# Altium project pca20053.PrjPCB (part 3 of 4)

## Sheet pca20053_sheet6_interface.SchDoc: Thingy:53 Interface
size A3; Organization: Nordic Semiconductor; DocumentNumber: 6; Revision: 1.1.0; SheetNumber: 6; SheetTotal: 6; Author: MASI; CompanyName: Nordic Semiconductor; DrawnBy: MASI; DocumentSize: A3; ProjectName: Thingy:53
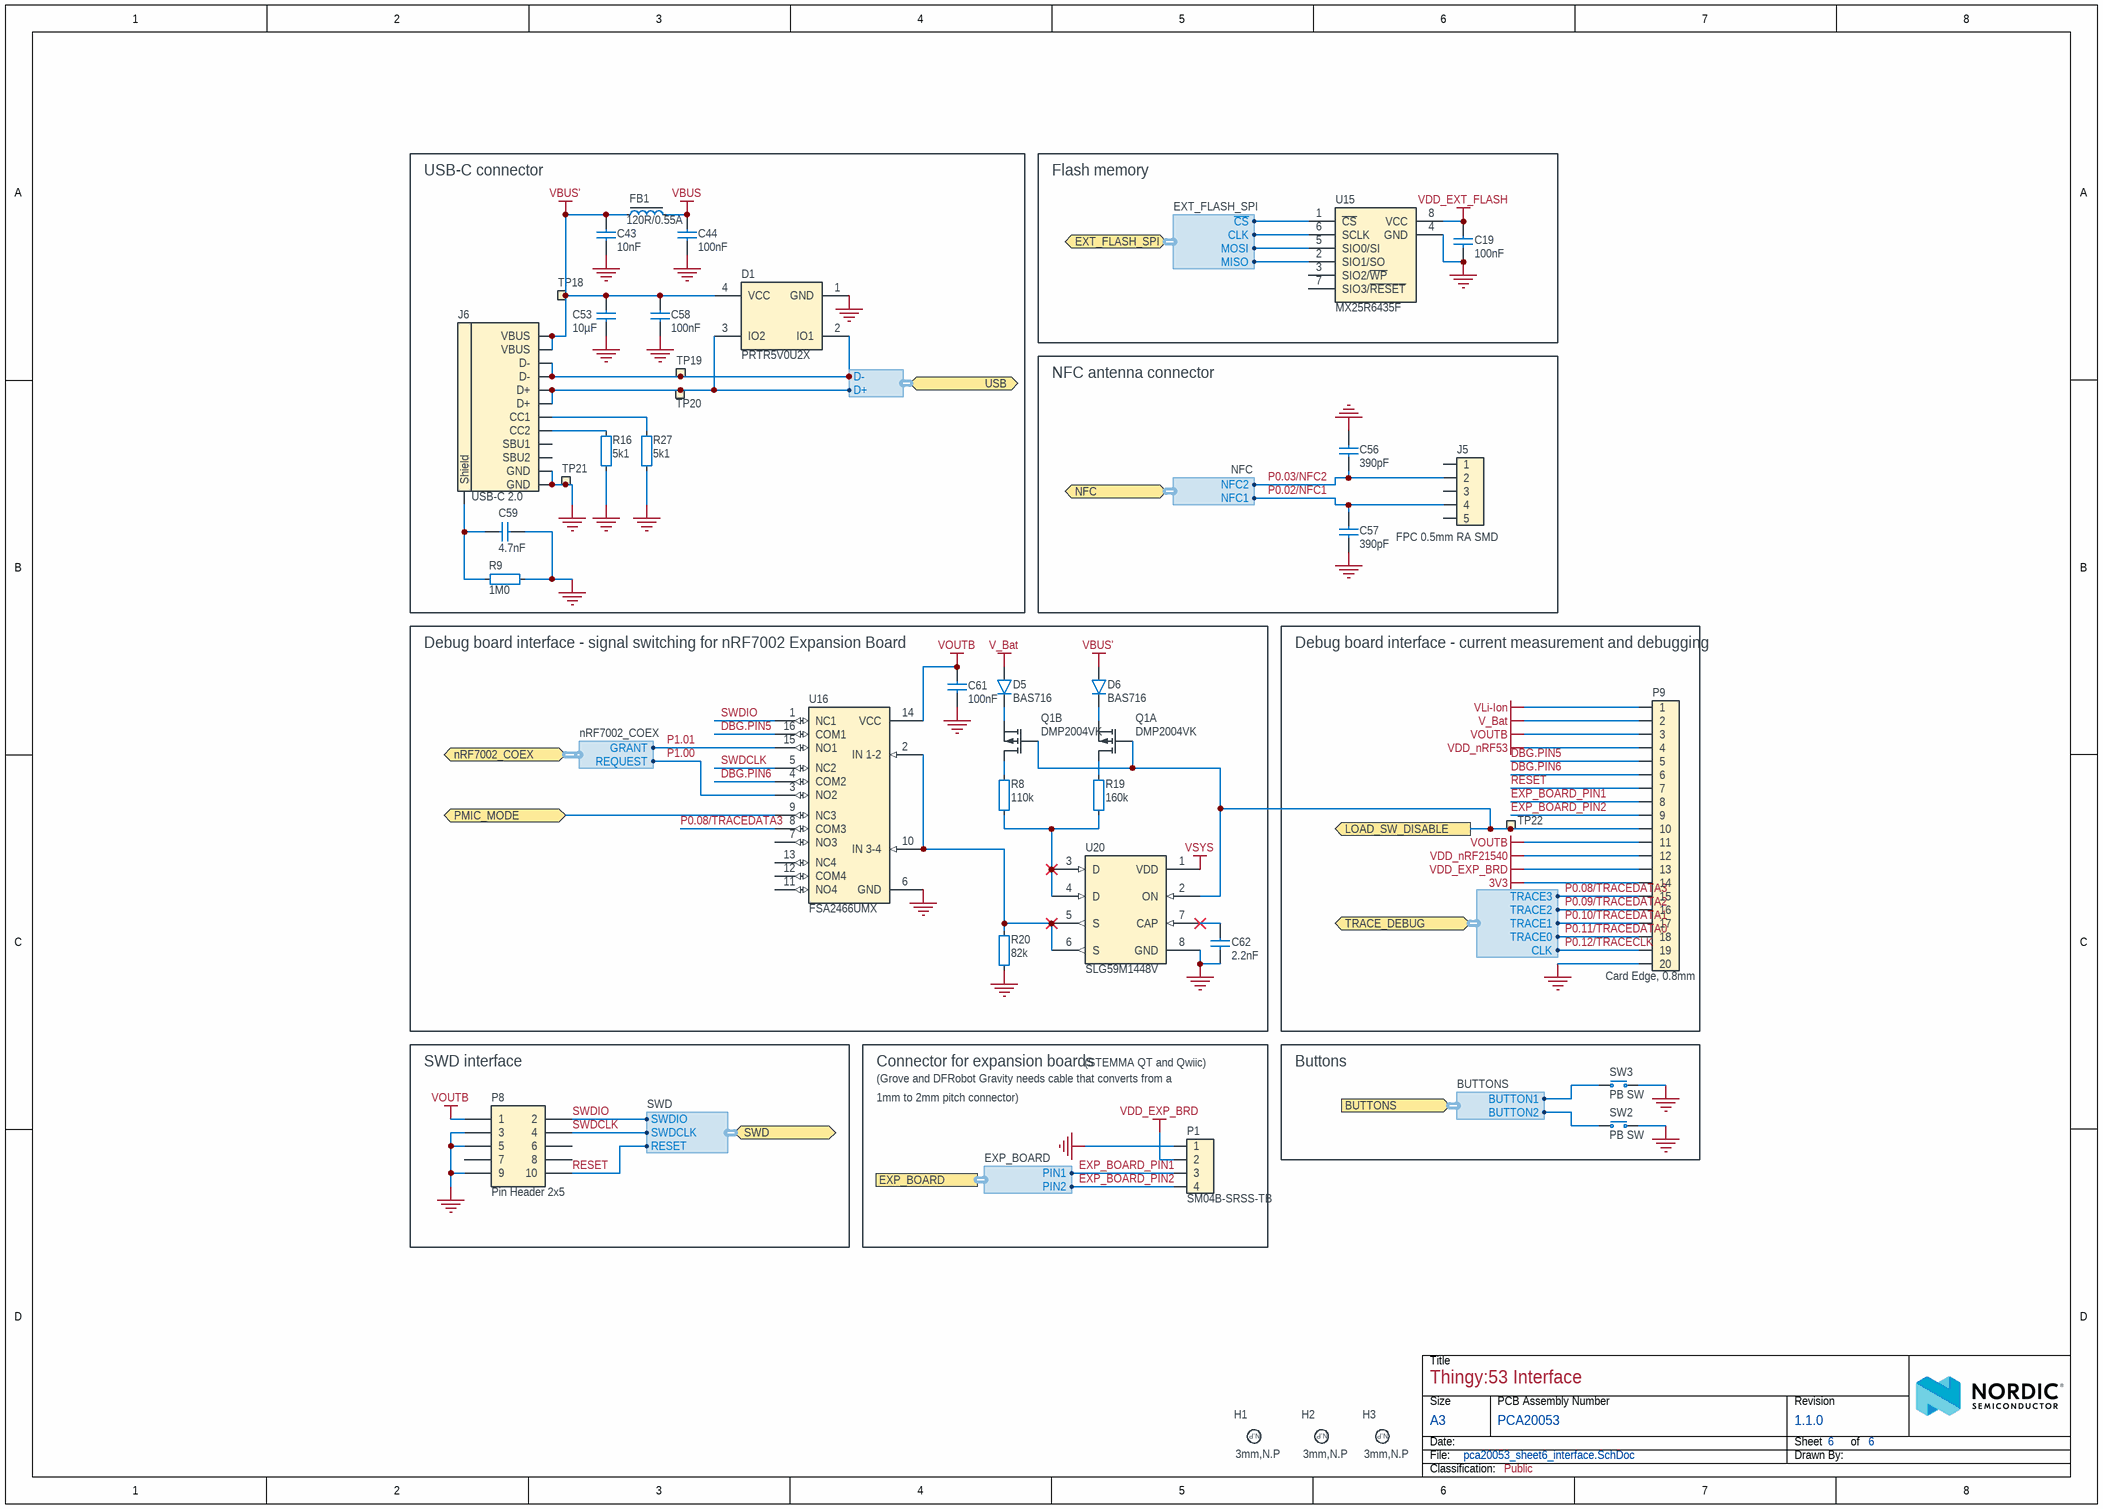
[diagram p4: pca20053_sheet6_interface.SchDoc]

### Parts
C19  100nF  [CAPC0603X03L_C]
C43  10nF  [CAPC0603X03L_C]
C44  100nF  [CAPC0603X03L_C]
C53  10µF  [CAPC1608X06L]
C56  390pF  [CAPC0603X03L_C]
C57  390pF  [CAPC0603X03L_C]
C58  100nF  [CAPC0603X03L_C]
C59  4.7nF  [CAPC0603X03L_C]
C61  100nF  [CAPC0603X03L_C]
C62  2.2nF  [CAPC0603X03L_C]
D1  PRTR5V0U2X  [SOT190P230X110-4L]
D5  BAS716  [SOD-523]
D6  BAS716  [SOD-523]
FB1  120R/0.55A  [INDC1005X04L]
H1  3mm,N.P  [HOLE_NP_3MM]  (no BOM)
H2  3mm,N.P  [HOLE_NP_3MM]  (no BOM)
H3  3mm,N.P  [HOLE_NP_3MM]  (no BOM)
J5  FPC 0.5mm RA SMD  [FPC_05P-0.5mm-RA-SMD]
J6  USB-C 2.0  [DX07S016JA1R1500]
P1  SM04B-SRSS-TB  [SM04B-SRSS-TB]
P8  Pin Header 2x5  [HDR_2x5-SMD-1.27mm-ANG]
P9  Card Edge, 0.8mm  [10056847-101LF]
Q1  DMP2004VK  [SOTFL50P162X60-6N]  (parts A,B of 2)
R8  110k  [RESC0603X03L_C]
R9  1M0  [RESC0603X03L_C]
R16  5k1  [RESC0603X03L_C]
R19  160k  [RESC0603X03L_C]
R20  82k  [RESC0603X03L_C]
R27  5k1  [RESC0603X03L_C]
SW2  PB SW  [SW_TACTILE_2.6x3.0MM_4-LEAD]
SW3  PB SW  [Switch-PB-6.2x6.3mm-SMD]
TP18  Ø1.5mm,SMD  [TP_SMD_D1.5mm]  (value not drawn)  (no BOM)
TP19  Ø1.5mm,SMD  [TP_SMD_D1.5mm]  (value not drawn)  (no BOM)
TP20  Ø1.5mm,SMD  [TP_SMD_D1.5mm]  (value not drawn)  (no BOM)
TP21  Ø1.5mm,SMD  [TP_SMD_D1.5mm]  (value not drawn)  (no BOM)
TP22  Ø1.5mm,SMD  [TP_SMD_D1.5mm]  (value not drawn)  (no BOM)
U15  MX25R6435F  [SON127P600X80_HS-9N]
U16  FSA2466UMX  [XQFN40P180X260X50-16N]
U20  SLG59M1448V  [SLG59M1448V]

### Blocks framed on the sheet
USB-C connector: C43 C44 C53 C58 C59 D1 FB1 J6 R9 R16 R27 TP18-TP21
Flash memory: C19 U15
NFC antenna connector: C56 C57 J5
Debug board interface - current measurement and debugging: P9 TP22
SWD interface: P8
Connector for expansion boards: P1
Buttons: SW2 SW3

### Ports
BUTTONS (in, harness BUTTONS), EXP_BOARD (harness EXP_BOARD), EXT_FLASH_SPI (bidir, harness EXT_FLASH_SPI), LOAD_SW_DISABLE (out), NFC (bidir, harness NFC), nRF7002_COEX (bidir, harness nRF7002_COEX), PMIC_MODE (bidir), SWD (bidir, harness SWD), TRACE_DEBUG (bidir, harness TRACE), USB (bidir, harness USB)

### Harnesses
SWD: SWDIO, SWDCLK, RESET
NFC: NFC2, NFC1
USB: D-, D+
TRACE: TRACE3, TRACE2, TRACE1, TRACE0, CLK
EXP_BOARD: PIN1, PIN2
BUTTONS: BUTTON1, BUTTON2
EXT_FLASH_SPI: ~{CS}, CLK, MOSI, MISO
nRF7002_COEX: REQUEST, GRANT

### Nets
3V3: P9.14
GND: C19.1 C43.1 C44.1 C53.1 C56.2 C57.1 C58.1 C59.2 C61.2 C62.2 D1.1(GND) J6.1(GND) J6.12(GND) P1.1 P8.3 P8.5 P8.9 P9.20 R9.2 R16.1 R20.1 R27.1 SW2.1(N.O) SW3.1(N.O) TP21.1 U15.4(GND) U15.9(GND) U16.6(GND) U20.8(GND)
V_Bat: D5.1(A) P9.2
VBUS: C44.2 FB1.2
VBUS': C43.2 C53.2 C58.2 D1.4(VCC) D6.1(A) FB1.1 J6.2(VBUS) J6.11(VBUS) TP18.1
VDD_EXP_BRD: P1.2 P9.13
VDD_EXT_FLASH: C19.2 U15.8(VCC)
VDD_nRF53: P9.4
VDD_nRF21540: P9.12
VLi-Ion: P9.1
VOUTB: C61.1 P8.1 P9.3 P9.11 U16.14(VCC)
VSYS: U20.1(VDD)
D_N: D1.2(IO1) J6.5(D-) J6.8(D-) TP19.1 ; port USB.D-
D_P: D1.3(IO2) J6.6(D+) J6.7(D+) TP20.1 ; port USB.D+
DBG.PIN5: P9.5 U16.16(COM1)
DBG.PIN6: P9.6 U16.4(COM2)
EN: P9.10 Q1.2(G1) Q1.5(G2) TP22.1 U20.2(ON) ; port LOAD_SW_DISABLE
EXP_BOARD_PIN1: P1.3 P9.8 ; port EXP_BOARD.PIN1
EXP_BOARD_PIN2: P1.4 P9.9 ; port EXP_BOARD.PIN2
P0.02/NFC1: C57.2 J5.4 ; port NFC.NFC1
P0.03/NFC2: C56.1 J5.2 ; port NFC.NFC2
P0.08/TRACEDATA3: P9.15 U16.8(COM3) ; port TRACE_DEBUG.TRACE3
P0.09/TRACEDATA2: P9.16 ; port TRACE_DEBUG.TRACE2
P0.10/TRACEDATA1: P9.17 ; port TRACE_DEBUG.TRACE1
P0.11/TRACEDATA0: P9.18 ; port TRACE_DEBUG.TRACE0
P0.12/TRACECLK: P9.19 ; port TRACE_DEBUG.CLK
P0.13/QSPI0: U15.5(SIO0/SI) ; port EXT_FLASH_SPI.MOSI
P0.14/QSPI1: U15.2(SIO1/SO) ; port EXT_FLASH_SPI.MISO
P0.17/QSPI_CLK: U15.6(SCLK) ; port EXT_FLASH_SPI.CLK
P0.18/QSPI_CS: U15.1(~{CS}) ; port EXT_FLASH_SPI.~{CS}
P1.00: U16.3(NO2) ; port nRF7002_COEX.REQUEST
P1.01: U16.15(NO1) ; port nRF7002_COEX.GRANT
P1.13: SW2.2(COM) ; port BUTTONS.BUTTON2
P1.14: SW3.2(COM) ; port BUTTONS.BUTTON1
RESET: P8.10 P9.7 ; port SWD.RESET  [project net ~{RESET}]
SWDCLK: P8.4 U16.5(NC2) ; port SWD.SWDCLK
SWDIO: P8.2 U16.1(NC1) ; port SWD.SWDIO
NetC59_1: C59.1 J6.13(Shield) R9.1
NetC62_1: C62.1 U20.7(CAP)
NetD5_3: D5.3(C) Q1.4(S2)
NetD6_3: D6.3(C) Q1.1(S1)
NetJ6_3: J6.3(CC1) R27.2
NetJ6_9: J6.9(CC2) R16.2
NetQ1_3: Q1.3(D2) R8.2
NetQ1_6: Q1.6(D1) R19.2
NetR8_1: R8.1 R19.1 U20.3(D) U20.4(D)
NetR20_2: R20.2 U16.2(IN_1-2) U16.10(IN_3-4) U20.5(S) U20.6(S)
NetSB7_1: U16.9(NC3) ; port PMIC_MODE

Not connected (* = marked no-connect by the designer): H1 1; H2 1; H3 1; J5 1 3 5; J6 4(SBU2) 10(SBU1); P8 6 7 8; U15 3(SIO2/~{WP}) 7(SIO3/~{RESET}); U16 7(NO3) 11(NO4) 12(COM4) 13(NC4)

### Notes on the sheet
- Debug board interface - signal switching for nRF7002 Expansion Board
- (Grove and DFRobot Gravity needs cable that converts from a
- 1mm to 2mm pitch connector)
- (STEMMA QT and Qwiic)
- Title
- Size
- Date:
- File:
- A3
- PCB Assembly Number
- Sheet         of
- Drawn By:
- Revision
- Classification:
- (in symbol Hole_3MM_NP) N.P

### Library data of the parts
C19 = C0201-100n-6.3V-X5R: Capacitor, Ceramic, X5R, ±10%, 6.3V; Manufacturer: Murata; Manufacturer Part Number: GRM033R60J104KE19D; Part number NEMS: 100200451; Artikkelnr Noca: N.A.; Pad Count: 2; Component Status: Active; Part Number: C0201-100n-6.3V-X5R; ComponentLink1URL: https://search.murata.co.jp/Ceramy/image/img/A01X/G101/ENG/GRM033R60J104KE19-01.pdf; ComponentLink1Description: Datasheet; ComponentLink2URL: https://www.murata.com/en-eu/products/productdetail?partno=GRM033R60J104KE19%23; ComponentLink2Description: Supplier link; HelpURL: N.A.; Footprint Doc: 0201; LatestRevisionDate: 2020-12-15; Published: 2020-12-15; Value: 100nF; Note: 6.3V; Supplier 1: Digi-Key; Supplier Part Number 1: 490-3167-1-ND; Supplier 2: N.A.; Supplier Part Number 2: N.A.; Part number IPS: N.A.; Component Class: Capacitors; PartId: 100200451; Author: rsk; Part number Norautron: N.A.
C43 = C0201-10n-25V-X5R: Capacitor, Ceramic, X5R, ±10%, 25V; Manufacturer: Murata; Manufacturer Part Number: GRM033R61E103KA12D; Part number NEMS: 100200458; Artikkelnr Noca: N.A.; Pad Count: 2; Component Status: Active; Part Number: C0201-10n-25V-X5R; LatestRevisionDate: 2020-12-16; Published: 2020-12-16; Value: 10nF; Note: 25V; Footprint Doc: 0201; Part number IPS: N.A.; ComponentLink1URL: https://search.murata.co.jp/Ceramy/image/img/A01X/G101/ENG/GRM033R61E103KA12-01.pdf; ComponentLink1Description: Datasheet; ComponentLink2URL: https://www.murata.com/en-global/products/productdetail?partno=GRM033R61E103KA12%23; ComponentLink2Description: Supplier link; HelpURL: N.A.; Supplier 1: Digi-Key; Supplier Part Number 1: 490-7194-1-ND; Supplier 2: Mouser; Supplier Part Number 2: 81-GRM033R61E103KA2D; Component Class: Capacitors; PartId: 100200458; Author: rsk; Part number Norautron: N.A.
C44 C58 = C0201-100n-25V-X5R: Capacitor, Ceramic, X5R, ±10%, 25V; Manufacturer: Murata; Manufacturer Part Number: GRM033R61E104KE14J; Part number NEMS: 100200459; Artikkelnr Noca: N.A.; Pad Count: 2; Component Status: Active; Part Number: C0201-100n-25V-X5R; LatestRevisionDate: 2020-12-16; Published: 2020-12-16; Value: 100nF; Note: 25V; Footprint Doc: 0201; Part number IPS: N.A.; ComponentLink1URL: https://search.murata.co.jp/Ceramy/image/img/A01X/G101/ENG/GRM033R61E104KE14-01.pdf; ComponentLink1Description: Datasheet; ComponentLink2URL: https://www.murata.com/en-global/products/productdetail?partno=GRM033R61E104KE14%23; ComponentLink2Description: Supplier link; HelpURL: N.A.; Supplier 1: Digi-Key; Supplier Part Number 1: 490-14571-1-ND; Supplier 2: Mouser; Supplier Part Number 2: 81-GRM033R61E104KE4J; Component Class: Capacitors; PartId: 100200459; Author: rsk; Part number Norautron: N.A.
C53 = C0603-10µ-25V-X5R-GRM188R61E106MA73J: Capacitor, Ceramic, X5R, ±20%, 25V; Manufacturer: Murata; Part number NEMS: 100200456; Artikkelnr Noca: N.A.; Pad Count: 2; Component Status: Active; Part Number: C0603-10µ-25V-X5R-GRM188R61E106MA73J; Manufacturer Part Number: GRM188R61E106MA73J; LatestRevisionDate: 2021-07-22; Published: 2020-12-16; Value: 10µF; Note: 25V; Footprint Doc: 0603; Part number IPS: N.A.; ComponentLink1URL: https://search.murata.co.jp/Ceramy/image/img/A01X/G101/ENG/GRM188R61E106MA73-01.pdf; ComponentLink1Description: Datasheet; ComponentLink2URL: https://www.murata.com/en-global/products/productdetail?partno=GRM188R61E106MA73%23; ComponentLink2Description: Supplier link; HelpURL: N.A.; Supplier 1: Digi-Key; Supplier Part Number 1: 490-12737-1-ND; Supplier 2: Mouser; Supplier Part Number 2: 81-GRM188R61E106MA3J; Component Class: Capacitors; PartId: 100200456; Author: rsk; Part number Norautron: N.A.
C56 C57 = C0201-390p: Capacitor, NP0, ±5%, 25V; Manufacturer: N.A.; Manufacturer Part Number: GRM0335C1E391JA01D; Part number NEMS: 100200051; Pad Count: 2; Component Status: Active; Part Number: C0201-390p; Footprint Doc: 0201; LatestRevisionDate: 2021-04-27; Published: 2014-11-13; Value: 390pF; Note: 25V; Artikkelnr Noca: N.A.; Part number IPS: N.A.; ComponentLink1URL: https://search.murata.co.jp/Ceramy/image/img/A01X/G101/ENG/GRM0335C1E391JA01-01.pdf; ComponentLink1Description: Datasheet; ComponentLink2URL: https://www.digikey.com/en/products/detail/murata-electronics/GRM0335C1E391JA01D/7363115; ComponentLink2Description: Supplier link; HelpURL: https://www.murata.com/en-global/products/productdetail?partno=GRM0335C1E391JA01%23; Supplier 1: Digi-Key; Supplier Part Number 1: 490-16371-1-ND; Supplier 2: Mouser; Supplier Part Number 2: 81-GRM0335C1E391JA1D; Component Class: Capacitors; PartId: 100200051; Author: rsk; Part number Norautron: N.A.
C59 = C0201-4n7-25V-X5R: Capacitor, Ceramic, X5R, ±10%, 25V; Manufacturer: Murata; Manufacturer Part Number: GRM033R61E472KA12D; Part number NEMS: 100200460; Artikkelnr Noca: N.A.; Pad Count: 2; Component Status: Active; Part Number: C0201-4n7-25V-X5R; ComponentLink1URL: https://search.murata.co.jp/Ceramy/image/img/A01X/G101/ENG/GRM033R61E472KA12-01.pdf; ComponentLink1Description: Datasheet; ComponentLink2URL: https://www.murata.com/en-global/products/productdetail?partno=GRM033R61E472KA12%23; ComponentLink2Description: Supplier link; HelpURL: N.A.; Footprint Doc: 0201; LatestRevisionDate: 2020-12-18; Published: 2020-12-16; Value: 4.7nF; Note: 25V; Supplier 1: Digi-Key; Supplier Part Number 1: 490-9993-1-ND; Supplier 2: Mouser; Supplier Part Number 2: 81-GRM33R61E472KA12D; Part number IPS: N.A.; Component Class: Capacitors; PartId: 100200460; Author: rsk; Part number Norautron: N.A.
C61 = C0201-100n: Capacitor, X5R, ±10%; Manufacturer: N.A.; Part number IPS: 00000001248, 00000002505; Part number Norautron: 262071862; Part number NEMS: 100200078; Note: 16V; Pad Count: 2; Component Status: Active; Part Number: C0201-100n; Manufacturer Part Number: N.A.; Footprint Doc: 0201; LatestRevisionDate: 2017-11-09; Published: 2014-11-13; Value: 100nF; Artikkelnr Noca: N.A.; ComponentLink1URL: N.A.; ComponentLink1Description: Datasheet; ComponentLink2URL: N.A.; ComponentLink2Description: Supplier link; HelpURL: N.A.; Supplier 1: N.A.; Supplier Part Number 1: N.A.; Supplier 2: N.A.; Supplier Part Number 2: N.A.; Author: rsk; Component Class: Capacitors; PartId: 100200078
C62 = C0201-2n2: Capacitor, X7R, ±10%, 10V; Part number IPS: 00000001778; Part number Norautron: 26470002; Part number NEMS: 100200060; Pad Count: 2; Artikkelnr Noca: N.A.; Component Status: Active; Part Number: C0201-2n2; Value: 2.2nF; Footprint Doc: 0201; Component Class: Capacitors; Author: rsk; ComponentLink1Description: Datasheet; ComponentLink1URL: N.A.; ComponentLink2Description: Supplier link; ComponentLink2URL: N.A.; HelpURL: N.A.; LatestRevisionDate: 2014-11-13; Manufacturer: N.A.; Manufacturer Part Number: N.A.; Note: 10V; PartId: 100200060; Published: 2014-11-13; Supplier 1: N.A.; Supplier 2: N.A.; Supplier Part Number 1: N.A.; Supplier Part Number 2: N.A.
D1 = PRTR5V0U2X: Ultra low capacitance double rail-to-rail ESD protection diode; Manufacturer: NXP Semiconductors; Part number IPS: 00000009951; Part number Norautron: 26313940; Part number NEMS: 101300082; Note: N.A.; Artikkelnr Noca: 10069015; Pad Count: 4; Component Status: Active; Part Number: PRTR5V0U2X; Manufacturer Part Number: PRTR5V0U2X; LatestRevisionDate: 2017-11-09; Published: 2012-06-11; Value: PRTR5V0U2X; Footprint Doc: SOT-143B; ComponentLink1URL: N.A.; ComponentLink1Description: Datasheet; ComponentLink2URL: N.A.; ComponentLink2Description: Supplier link; HelpURL: http://www.farnell.com/datasheets/109718.pdf; Supplier 1: Digi-Key; Supplier Part Number 1: 568-4140-1-ND; Supplier 2: Farnell; Supplier Part Number 2: 152-4157; Component Class: Semiconductors; PartId: 101300082; Author: rsk
D5 D6 = BAS716: Low-leakage diode, Diode gen. purpose, Vf=1.25 V @ 150 mA, Ir=5.0 nA @ 75 V, If=200 mA; Manufacturer: Nexperia; Part number NEMS: 101300193; Pad Count: 2; Note: N.A.; Component Status: Active; Part Number: BAS716; PartId: 101300193; Component Class: Semiconductors; Manufacturer Part Number: BAS716; ComponentLink1URL: https://assets.nexperia.com/documents/data-sheet/BAS716.pdf; ComponentLink1Description: Datasheet; ComponentLink2URL: https://www.digikey.com/en/products/detail/nexperia-usa-inc/BAS716-115/1232107; ComponentLink2Description: Supplier link; HelpURL: https://www.nexperia.com/products/diodes/automotive-diodes/automotive-switching-diodes/automotive-low-leakage-current-switching-diodes/BAS716.html; Footprint Doc: SOD-523; LatestRevisionDate: 2022-08-23; Published: 2022-08-23; Value: BAS716; Supplier 1: Digi-Key; Supplier Part Number 1: 1727-4813-1-ND; Supplier 2: Mouser; Supplier Part Number 2: 771-BAS716-T/R; Artikkelnr Noca: N.A.; Part number IPS: N.A.; Author: rubr; Part number Norautron: N.A.
FB1 = FB0402-120R@100M-500mA: Ferrite Bead, 120 Ohm @ 100MHz, 500mA, 250 mOhm Max; Manufacturer: Murata; Manufacturer Part Number: BLM15AG121SN1D; Part number IPS: 00000009954; Part number Norautron: 265230631; Part number NEMS: 100300099; Note: Chip EMIFIL Inductor Type Chip Ferrite Bead; Artikkelnr Noca: 33029317; Pad Count: 2; Component Status: Active; Part Number: FB0402-120R@100M-500mA; Footprint Doc: 0402; LatestRevisionDate: 2014-01-10; Published: 2011-11-14; Value: 120R/0.55A; ComponentLink1Description: Datasheet; ComponentLink2Description: Supplier link; ComponentLink1URL: N.A.; ComponentLink2URL: N.A.; HelpURL: http://search.murata.co.jp/Ceramy/image/img/PDF/ENG/L0110S0100BLM15A_SN.pdf; Supplier 1: Digi-Key; Supplier Part Number 1: 490-1005-1-ND; Supplier 2: Farnell; Supplier Part Number 2: 151-5760; Component Class: Inductors; PartId: 100300099; Author: rsk
H1-H3 = Hole_3MM_NP: Regular Non-Plated, 3mm hole; Manufacturer: Nordic Semiconductor; Manufacturer Part Number: N.A.; Part number NEMS: 100500145; Pad Count: 1; Component Status: Active; System: Connector; Part Number: Hole_3MM_NP; Footprint Doc: Hole_3MM_NP; LatestRevisionDate: 2009-12-12; Published: 2009-12-12; Value: 3mm,N.P; Note: Regular Non-Plated, 3mm hole; Artikkelnr Noca: N.A.; Part number IPS: N.A.; ComponentLink1URL: N.A.; ComponentLink1Description: Datasheet; ComponentLink2URL: N.A.; ComponentLink2Description: Supplier link; HelpURL: N.A.; Supplier 1: N.A.; Supplier Part Number 1: N.A.; Supplier 2: N.A.; Supplier Part Number 2: N.A.; Component Class: Connectors; PartId: 100500145; Author: rsk; Part number Norautron: N.A.
J5 = FPC_05P-0.5mm-RA-SMD: 0.5mm FPC, 5P,Right Angle SMT,Double Contact,H=1.2mm,White, Tin plated; Manufacturer: W-CON; Manufacturer Part Number: 5141-05RZDNWR02; Part number IPS: 00000007792; Part number Norautron: 26032377; Part number NEMS: 100500528; Note: N.A.; Artikkelnr Noca: 55010020; Pad Count: 7; Component Status: Active; System: Connector; Part Number: FPC_05P-0.5mm-RA-SMD; Footprint Doc: FPC_05P-0.5mm-RA-SMD; LatestRevisionDate: 2021-09-24; Published: 2015-06-22; Value: FPC 0.5mm RA SMD; ComponentLink1URL: N.A.; ComponentLink1Description: Datasheet; ComponentLink2URL: N.A.; ComponentLink2Description: Supplier link; HelpURL: \\hizz\pro\app9717\Datasheet\connectors\W-CON\5141-05RZDNXX02.pdf; Supplier 1: Cabcon; Supplier Part Number 1: 5141-05RZDNWR02; Supplier 2: Digi-Key; Supplier Part Number 2: WM9836CT-ND; Component Class: Connectors; PartId: 100500528; Author: rsk
J6 = DX07S016JA3R1500: USB-C Receptacle, 16 Pin, USB 2.0; Manufacturer: JAE Electronics; Part number Norautron: 26470007; Part number NEMS: 100500670; Pad Count: 16; Note: N.A.; Component Status: Active; System: Connector; Part Number: DX07S016JA3R1500; PartId: 100500670; Component Class: Connectors; Manufacturer Part Number: DX07S016JA3R1500; ComponentLink1URL: N.A.; ComponentLink1Description: Datasheet; ComponentLink2URL: N.A.; ComponentLink2Description: Supplier link; HelpURL: https://www.jae.com/en/connectors/series/detail/product/id=91780; Footprint Doc: DX07S016JA1R1500; LatestRevisionDate: 2020-05-06; Published: 2020-05-06; Value: USB-C 2.0; Supplier 1: Digi-Key; Supplier Part Number 1: 670-DX07S016JA3R1500CT-ND; Supplier 2: Mouser; Supplier Part Number 2: 656-DX07S016JA3R1500; Artikkelnr Noca: N.A.; Part number IPS: N.A.; Author: rsk
P1 = SM04B-SRSS-TB: JST SR/SH 1.0mm 4-pin; Manufacturer: JST Sales America Inc.; Part number NEMS: 100500540; Note: N.A.; Pad Count: 4; Component Status: Active; System: Connector; Part Number: SM04B-SRSS-TB; Manufacturer Part Number: SM04B-SRSS-TB; ComponentLink1URL: N.A.; ComponentLink1Description: Datasheet; ComponentLink2URL: N.A.; ComponentLink2Description: Supplier link; HelpURL: http://www.jst-mfg.com/product/pdf/eng/eSH.pdf; Footprint Doc: JST SR/SH 1.0mm 4-pin; LatestRevisionDate: 2020-09-01; Published: 2015-11-16; Value: SM04B-SRSS-TB; Supplier 1: Cabcon; Supplier Part Number 1: SM04B-SRSS-TB; Supplier 2: Digi-Key; Supplier Part Number 2: 455-1804-1-ND; Artikkelnr Noca: N.A.; Part number IPS: N.A.; Component Class: Connectors; PartId: 100500540; Author: rsk; Part number Norautron: N.A.
P8 = Pin Header 2x5 SMD, 1.27mm, Angled: Pin Header 2x5, 1.27mm (50mil); Manufacturer: W-CON; Manufacturer Part Number: 1325B-1205S0Z080CR02; Part number IPS: 00000007800; Part number Norautron: 26470011; Part number NEMS: 100500257; Note: N.A.; Pad Count: 10; Component Status: Active; System: Connector; Part Number: Pin Header 2x5 SMD, 1.27mm, Angled; LatestRevisionDate: 2019-11-20; Published: 2014-01-22; Value: Pin Header 2x5; Artikkelnr Noca: N.A.; Footprint Doc: HDR_2x5-SMD-1.27mm-ANG; ComponentLink1URL: N.A.; ComponentLink1Description: Datasheet; ComponentLink2URL: N.A.; ComponentLink2Description: Supplier link; HelpURL: \\hizz\pro\app9717\Datasheet\connectors\W-CON\1325B-12XXXXZXXXCXXX.pdf; Supplier 1: Cabcon; Supplier Part Number 1: 1325B-1205S0Z080CR02; Supplier 2: Samtec; Supplier Part Number 2: FTSH-105-01-L-DH-A-C-TR; Component Class: Connectors; PartId: 100500257; Author: rsk
P9 = 10056847-101LF: 0.8mm pitch, dual edge, right angle, SMD, card edge connector; Manufacturer: FCI; Part number NEMS: 100500633; Note: N.A.; Pad Count: 20; Component Status: Active; Part Number: 10056847-101LF; Manufacturer Part Number: 10056847-101LF; ComponentLink1URL: https://www.amphenol-icc.com/media/wysiwyg/files/drawing/10056847.pdf; ComponentLink1Description: Datasheet; ComponentLink2URL: N.A.; ComponentLink2Description: Supplier link; HelpURL: N.A.; Footprint Doc: 10056847-101LF; LatestRevisionDate: 2018-05-07; Published: 2018-05-07; Value: Card Edge, 0.8mm; Supplier 1: Digi-Key; Supplier Part Number 1: 609-4943-1-ND; Supplier 2: N.A.; Supplier Part Number 2: N.A.; Artikkelnr Noca: N.A.; Part number IPS: N.A.; Component Class: Connectors; PartId: 100500633; Author: rsk; Part number Norautron: N.A.; System: Connector
Q1 = DMP2004VK-7: Dual 2 P-Channel MOSFET, 530mA, 900mOhm, 400mW, 20V; Manufacturer: Diodes Incorporated; Part number NEMS: 101300195; Note: N.A.; Pad Count: 6; Component Status: Active; Part Number: DMP2004VK-7; Manufacturer Part Number: DMP2004VK-7; ComponentLink1URL: https://www.diodes.com/assets/Datasheets/ds30916.pdf; ComponentLink1Description: Datasheet; ComponentLink2URL: https://www.digikey.com/en/products/detail/diodes-incorporated/DMP2004VK-7/1774202; ComponentLink2Description: Supplier link; HelpURL: https://www.diodes.com/part/view/DMP2004VK/; Footprint Doc: SOT-563; LatestRevisionDate: 2022-09-08; Published: 2022-09-08; Value: DMP2004VK; Supplier 1: Digi-Key; Supplier Part Number 1: DMP2004VKDICT-ND; Supplier 2: N.A.; Supplier Part Number 2: N.A.; Artikkelnr Noca: N.A.; Part number IPS: N.A.; PartId: 101300195; Component Class: Semiconductors; Author: rubr; Part number Norautron: N.A.
R8 = R0201-110k: Resistor, ±1%, 0.05W; Manufacturer: N.A.; Part number NEMS: 100100570; Note: Chip Res 1%; Pad Count: 2; Component Status: Active; Part Number: R0201-110k; Manufacturer Part Number: N.A.; ComponentLink1URL: N.A.; ComponentLink1Description: Datasheet; ComponentLink2URL: N.A.; ComponentLink2Description: Supplier link; HelpURL: N.A.; Footprint Doc: 0201; LatestRevisionDate: 2016-12-01; Published: 2016-12-01; Value: 110k; Supplier 1: N.A.; Supplier Part Number 1: N.A.; Supplier 2: N.A.; Supplier Part Number 2: N.A.; Artikkelnr Noca: N.A.; Part number IPS: N.A.; Component Class: Resistors; PartId: 100100570; Author: rsk; Part number Norautron: N.A.
R9 = R0201-1M0: Resistor, ±1%, 0.05W; Manufacturer: N.A.; Part number IPS: 00000001418; Part number Norautron: 26107108; Part number NEMS: 100100093; Note: Chip Res 1%; Pad Count: 2; Component Status: Active; Part Number: R0201-1M0; Manufacturer Part Number: N.A.; ComponentLink1URL: N.A.; ComponentLink1Description: Datasheet; ComponentLink2URL: N.A.; ComponentLink2Description: Supplier link; HelpURL: N.A.; Footprint Doc: 0201; LatestRevisionDate: 2014-11-13; Published: 2014-11-13; Value: 1M0; Supplier 1: N.A.; Supplier Part Number 1: N.A.; Supplier 2: N.A.; Supplier Part Number 2: N.A.; Artikkelnr Noca: N.A.; Component Class: Resistors; PartId: 100100093; Author: rsk
R16 R27 = R0201-5k1: Resistor, ±1%, 0.05W; Manufacturer: N.A.; Part number Norautron: 26192285; Part number NEMS: 100100565; Pad Count: 2; Note: Chip Res 1%; Component Status: Active; Part Number: R0201-5k1; PartId: 100100565; Component Class: Resistors; Manufacturer Part Number: N.A.; ComponentLink1URL: N.A.; ComponentLink1Description: Datasheet; ComponentLink2URL: N.A.; ComponentLink2Description: Supplier link; HelpURL: N.A.; Footprint Doc: 0201; LatestRevisionDate: 2016-04-20; Published: 2016-04-20; Value: 5k1; Supplier 1: N.A.; Supplier Part Number 1: N.A.; Supplier 2: N.A.; Supplier Part Number 2: N.A.; Artikkelnr Noca: N.A.; Part number IPS: N.A.; Author: rsk
R19 = R0201-160k: Resistor, ±1%, 0.05W; Manufacturer: N.A.; Part number NEMS: 100100657; Note: Chip Res 1%; Pad Count: 2; Component Status: Active; Part Number: R0201-160k; Manufacturer Part Number: N.A.; ComponentLink1URL: N.A.; ComponentLink1Description: Datasheet; ComponentLink2URL: N.A.; ComponentLink2Description: Supplier link; HelpURL: N.A.; Footprint Doc: 0201; LatestRevisionDate: 2022-03-28; Published: 2022-03-28; Value: 160k; Supplier 1: N.A.; Supplier Part Number 1: N.A.; Supplier 2: N.A.; Supplier Part Number 2: N.A.; Artikkelnr Noca: N.A.; Part number IPS: N.A.; Component Class: Resistors; PartId: 100100657; Author: hany; Part number Norautron: N.A.
R20 = R0201-82k: Resistor, ±1%, 0.05W; Manufacturer: N.A.; Part number IPS: 00000004801; Part number NEMS: 100100079; Note: Chip Res 1%; Pad Count: 2; Component Status: Active; Part Number: R0201-82k; Manufacturer Part Number: N.A.; ComponentLink1URL: N.A.; ComponentLink1Description: Datasheet; ComponentLink2URL: N.A.; ComponentLink2Description: Supplier link; HelpURL: N.A.; Footprint Doc: 0201; LatestRevisionDate: 2014-11-13; Published: 2014-11-13; Value: 82k; Supplier 1: N.A.; Supplier Part Number 1: N.A.; Supplier 2: N.A.; Supplier Part Number 2: N.A.; Artikkelnr Noca: N.A.; Component Class: Resistors; PartId: 100100079; Author: rsk; Part number Norautron: N.A.
SW2 = KMT021 NGJ LHS: Nano-Miniature Top Actuated Tact Switch with extended life 3.0x2.6mm; Manufacturer: C&K; Part number IPS: 00000005416; Part number NEMS: 101500039; Note: N.A.; Pad Count: 4; Component Status: Active; Part Number: KMT021 NGJ LHS; Manufacturer Part Number: KMT021 NGJ LHS; ComponentLink1URL: N.A.; ComponentLink1Description: Datasheet; ComponentLink2URL: N.A.; ComponentLink2Description: Supplier link; HelpURL: http://media.digikey.com/pdf/Data%20Sheets/C&K/KMT_0xx_NGJ_LHS_Drawing.pdf; Footprint Doc: SW_TACTILE_2.6x3.0MM_4-LEAD; LatestRevisionDate: 2013-08-12; Published: 2013-08-12; Value: PB SW; Supplier 1: Digi-Key; Supplier Part Number 1: CKN10289CT-ND; Supplier 2: Farnell; Supplier Part Number 2: 190-8260; Artikkelnr Noca: N.A.; Component Class: Switches; PartId: 101500039; Author: rsk; Part number Norautron: N.A.
SW3 = Switch-PB-6.2x6.3mm-SMD: Tactile Switch, SPNO, SMD, 160gf, 6.2x6.3x2.5mm; Manufacturer: Dailywell; Manufacturer Part Number: TS604VM1-025BR-R; Part number IPS: 00000007812; Part number NEMS: 101500001, 101500133; Note: N.A.; Artikkelnr Noca: 50019106; Pad Count: 4; Component Status: Active; Part Number: Switch-PB-6.2x6.3mm-SMD; Footprint Doc: Switch-PB-6.2x6.3mm-SMD; LatestRevisionDate: 2016-04-21; Published: 2010-02-01; Value: PB SW; ComponentLink1URL: N.A.; ComponentLink1Description: Datasheet; ComponentLink2URL: N.A.; ComponentLink2Description: Supplier link; HelpURL: \\hizz\pro\app9717\Datasheet\switches\Dailywell\TS604VM1-025BR-R.pdf; Supplier 1: Cabcon; Supplier Part Number 1: TS604VM1-025BR-R; Supplier 2: Mouser; Supplier Part Number 2: 688-SKHUALE010; Component Class: Switches; PartId: 101500001; Author: rsk; Part number Norautron: N.A.
TP18-TP22 = TP_SMD_Ø1.5MM: 1.5mm circular SMD testpad; Manufacturer: Nordic Semiconductor; Manufacturer Part Number: N.A.; Part number NEMS: 100500477; Pad Count: 1; Component Status: Active; System: Connector; Part Number: TP_SMD_Ø1.5MM; LatestRevisionDate: 2021-03-05; Published: 2016-06-02; Value: Ø1.5mm,SMD; Note: N.A.; Artikkelnr Noca: N.A.; Footprint Doc: TP_SMD_Ø1.5mm; Part number IPS: N.A.; ComponentLink1URL: N.A.; ComponentLink1Description: Datasheet; ComponentLink2URL: N.A.; ComponentLink2Description: Supplier link; HelpURL: N.A.; Supplier 1: N.A.; Supplier Part Number 1: N.A.; Supplier 2: N.A.; Supplier Part Number 2: N.A.; Component Class: Connectors; PartId: 100500477; Author: rsk; Part number Norautron: N.A.
U15 = MX25R6435FZNIL0: Ultra low power, 64M-bit, serial multi I/O flash memory; Manufacturer: Macronix; Part number IPS: 00000004370; Part number NEMS: 101900438; Note: N.A.; Artikkelnr Noca: 15020015; Pad Count: 8; Component Status: Active; Part Number: MX25R6435FZNIL0; Manufacturer Part Number: MX25R6435FZNIL0; ComponentLink1URL: N.A.; ComponentLink1Description: Datasheet; ComponentLink2URL: N.A.; ComponentLink2Description: Supplier link; HelpURL: https://www.macronix.com/Lists/Datasheet/Attachments/7913/MX25R6435F,%20Wide%20Range,%2064Mb,%20v1.5.pdf; Footprint Doc: WSON-8; LatestRevisionDate: 2021-02-26; Published: 2016-06-29; Value: MX25R6435F; Supplier 1: Future; Supplier Part Number 1: MX25R6435FZNIL0; Supplier 2: Arrow; Supplier Part Number 2: MX25R6435FZNIL0; Component Class: Misc_ICs; PartId: 101900438; Author: rsk; Part number Norautron: N.A.
U16 = FSA2466UMX: Data / Audio Low-Voltage Dual DPDT Analog Switch; Manufacturer: ON Semiconductor; Part number IPS: 00000009986; Part number Norautron: 26500608; Part number NEMS: 101900422; Note: N.A.; Artikkelnr Noca: 15070069; Pad Count: 16; Component Status: Active; Part Number: FSA2466UMX; Manufacturer Part Number: FSA2466UMX; ComponentLink1URL: N.A.; ComponentLink1Description: Datasheet; ComponentLink2URL: N.A.; ComponentLink2Description: Supplier link; HelpURL: https://www.onsemi.com/pub/Collateral/FSA2466-D.PDF; Footprint Doc: UFQFN-16; LatestRevisionDate: 2019-05-15; Published: 2016-05-18; Value: FSA2466UMX; Supplier 1: Digi-Key; Supplier Part Number 1: FSA2466UMXCT-ND; Supplier 2: Mouser; Supplier Part Number 2: 512-FSA2466UMX; Author: rsk; Component Class: Misc_ICs; PartId: 101900422
U20 = SLG59M1448V: Ultra-small Dual 17 mΩ, 2.5 A Load Switc with Discharge; Manufacturer: Dialog Semiconductor; Part number NEMS: 101900739; Note: N.A.; Pad Count: 8; Component Status: Active; Part Number: SLG59M1448V; Manufacturer Part Number: SLG59M1448V; ComponentLink1URL: https://www.renesas.com/us/en/document/dst/slg59m1448v-datasheet?language=en; ComponentLink1Description: Datasheet; ComponentLink2URL: N.A.; ComponentLink2Description: Supplier link; HelpURL: https://www.dialog-semiconductor.com/products/slg59m1448v; Footprint Doc: STDFN-8; LatestRevisionDate: 2022-12-14; Published: 2022-12-14; Value: SLG59M1448V; Supplier 1: Digi-Key; Supplier Part Number 1: 1827-1061-1-ND; Supplier 2: N.A.; Supplier Part Number 2: N.A.; Artikkelnr Noca: N.A.; Part number IPS: N.A.; Component Class: Misc_ICs; Author: masi; Part number Norautron: N.A.; PartId: 101900739